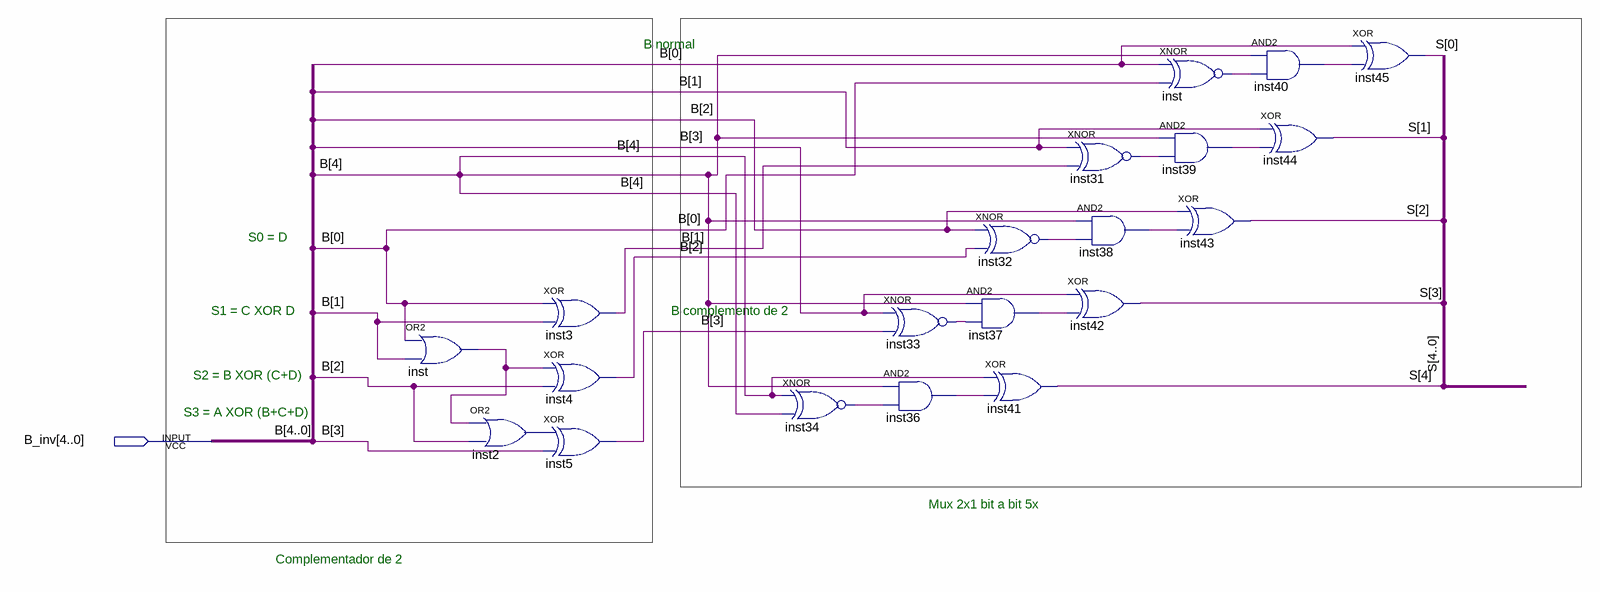
[diagram p0: schematic sheet]
// Quartus schematic Renan-diretorio.bdf as structural Verilog: 20 symbols, 1 pins
module \Renan-diretorio  (
  input  [4:0] B_inv
);

  wire inst2_out, inst31_out, inst32_out, inst33_out, inst34_out, inst36_out, inst37_out, inst38_out,
       inst39_out, inst40_out, inst_out, inst_out_2;
  wire [4:0] S;

  or inst (inst_out, B_inv[0], B_inv[1]);
  or inst2 (inst2_out, inst_out, B_inv[2]);
  xor inst3 (B_inv[1], B_inv[0], B_inv[1]);
  xor inst4 (B_inv[2], inst_out, B_inv[2]);
  xor inst5 (B_inv[3], inst2_out, B_inv[3]);
  xnor inst34 (inst34_out, B_inv[4], B_inv[4]);
  xnor inst33 (inst33_out, B_inv[3], B_inv[3]);
  and inst36 (inst36_out, B_inv[4], inst34_out);
  xnor inst32 (inst32_out, B_inv[2], B_inv[2]);
  and inst37 (inst37_out, B_inv[4], inst33_out);
  xor inst41 (S[4], B_inv[4], inst36_out);
  xnor inst31 (inst31_out, B_inv[1], B_inv[1]);
  xor inst42 (S[3], B_inv[3], inst37_out);
  and inst38 (inst38_out, B_inv[4], inst32_out);
  xnor inst_dup2 (inst_out_2, B_inv[0], B_inv[0]);
  and inst39 (inst39_out, B_inv[4], inst31_out);
  xor inst43 (S[2], B_inv[2], inst38_out);
  and inst40 (inst40_out, B_inv[4], inst_out_2);
  xor inst44 (S[1], B_inv[1], inst39_out);
  xor inst45 (S[0], B_inv[0], inst40_out);

  // Other names for the same wires on the sheet: B[4:0] = B_inv

  // Notes on the sheet:
  //   B normal
  //   S0 = D
  //   S1 = C XOR D
  //   B complemento de 2
  //   S2 = B XOR (C+D) 
  //   S3 = A XOR (B+C+D)
  //   Mux 2x1 bit a bit 5x
  //   Complementador de 2
endmodule
